# EAGLE schematic top (EAGLE 9.3.0)
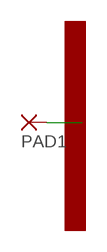
[diagram p0: schematic, sheet 1]

## Parts
PAD1  2,54/0,8  [2,54/0,8]

## Nets
N$1: PAD1.1(P)

## Library data of the parts
PAD1 = wirepad:2,54/0,8: THROUGH-HOLE PAD